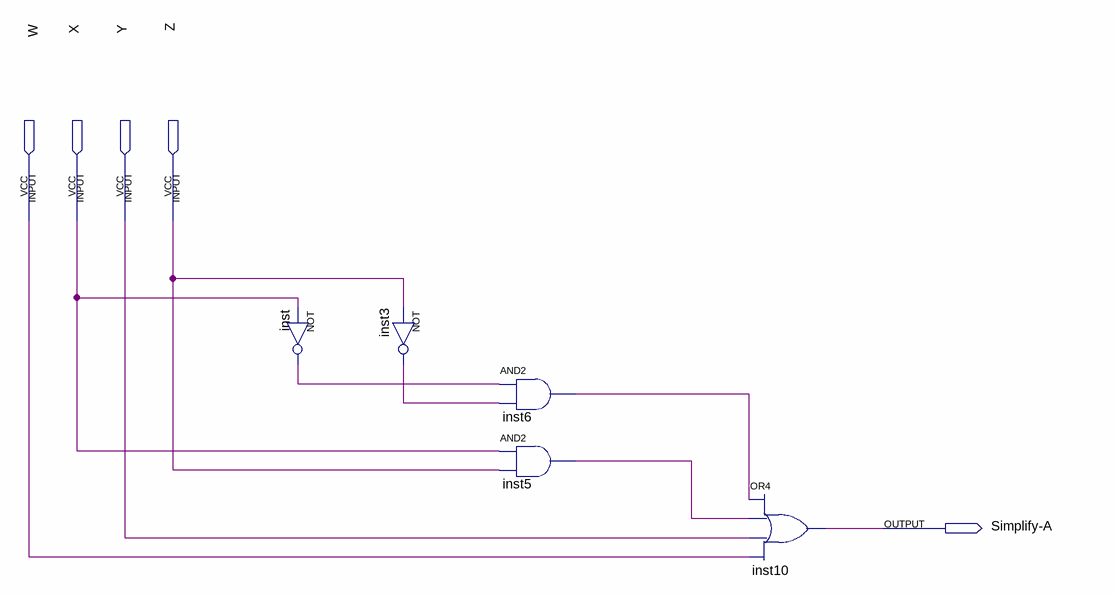
[diagram p0: schematic sheet]
// Quartus schematic Simplify-A.bdf as structural Verilog: 5 symbols, 5 pins
module \Simplify-A  (
  input  W,
  input  X,
  input  Y,
  input  Z,
  output \Simplify-A 
);

  wire inst3_out, inst5_out, inst6_out, inst_out;

  not inst (inst_out, X);
  not inst3 (inst3_out, Z);
  and inst6 (inst6_out, inst_out, inst3_out);
  and inst5 (inst5_out, X, Z);
  or inst10 (\Simplify-A , inst6_out, inst5_out, Y, W);
endmodule
